# EAGLE schematic untitled (EAGLE 8.2.0)
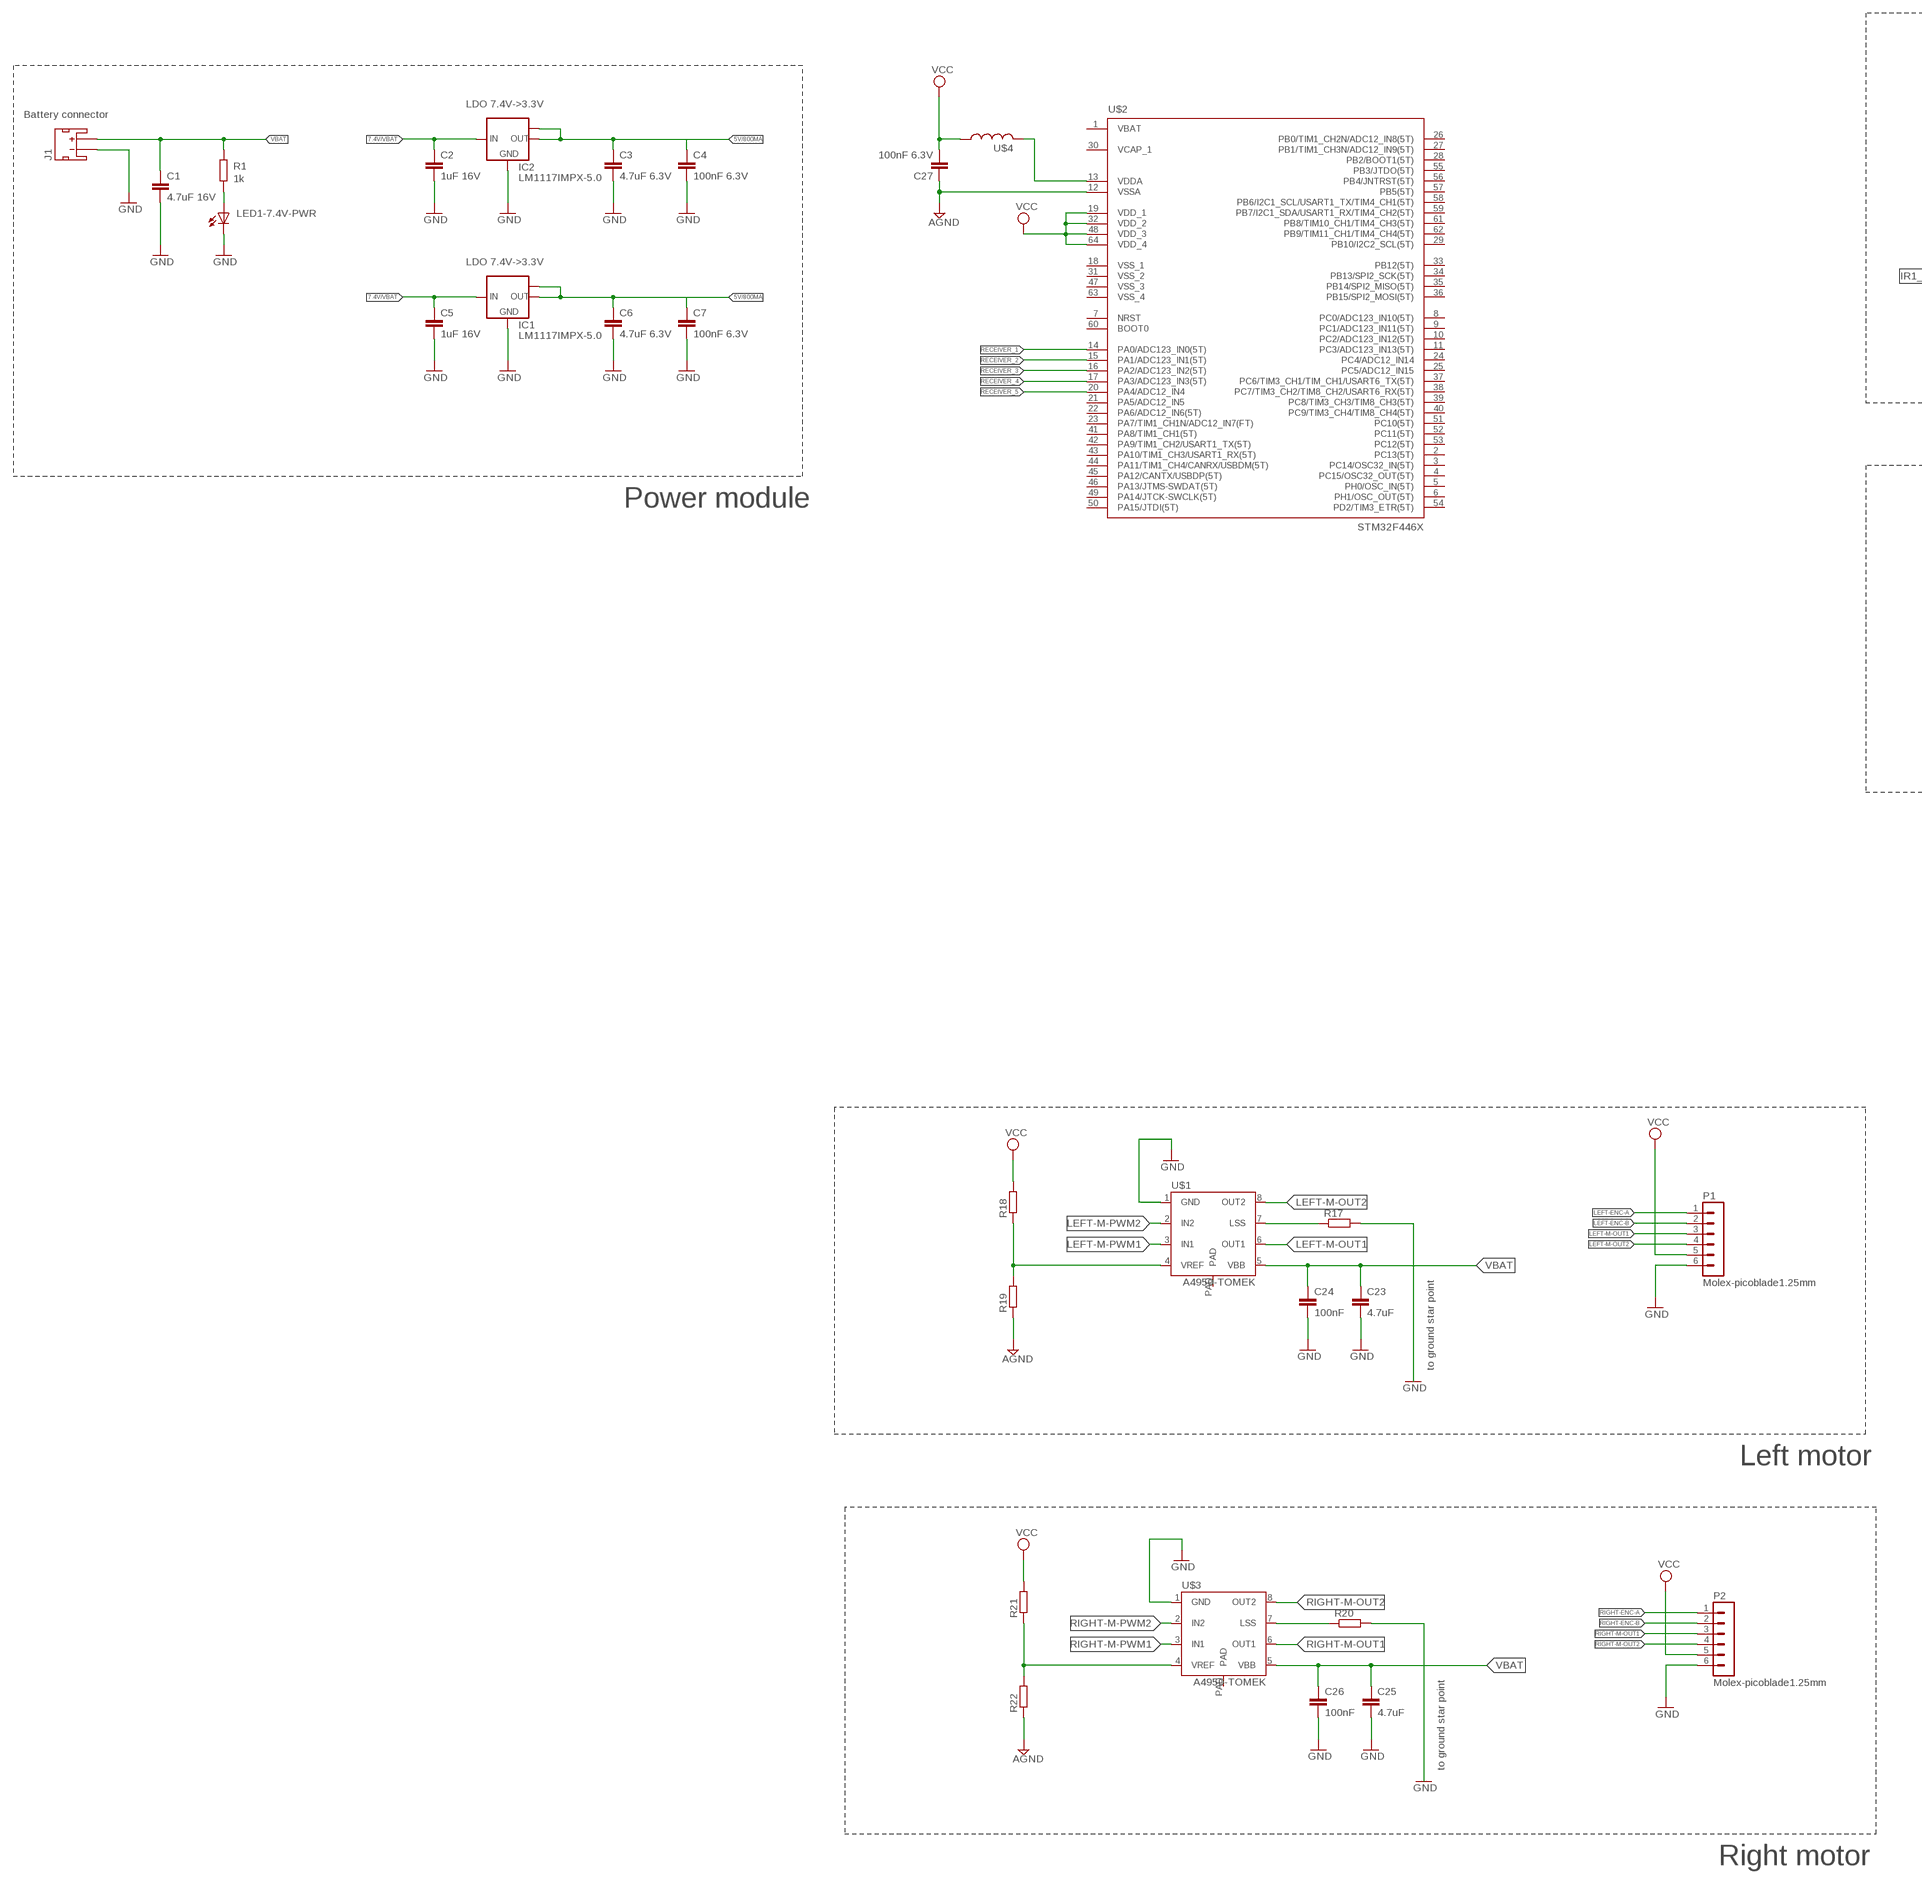
[diagram p0: schematic, sheet 1, part 1 of 2]
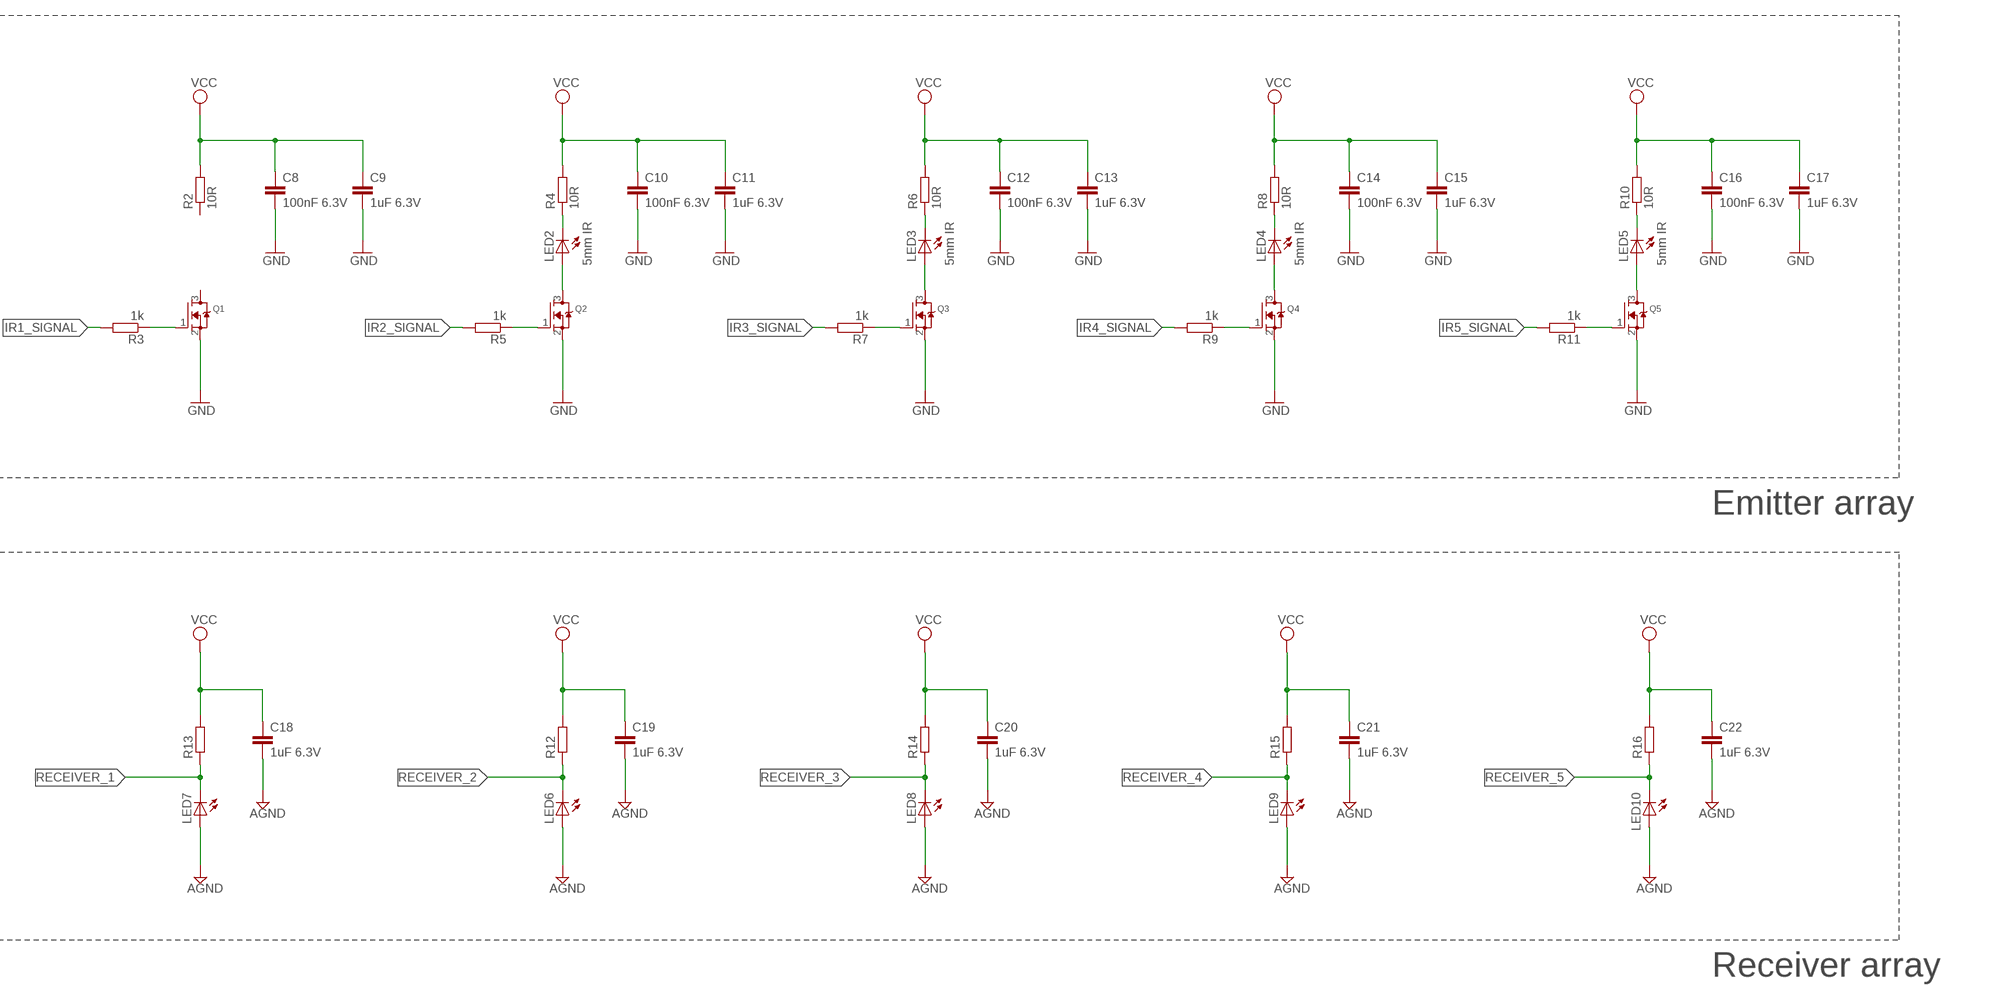
[diagram p1: schematic, sheet 1, part 2 of 2]

## Parts
C1  4.7uF 16V  C-EUC0805K  [C0805K]
C2  1uF 16V  C-EUC0805K  [C0805K]
C3  4.7uF 6.3V  C-EUC0805K  [C0805K]
C4  100nF 6.3V  C-EUC0805K  [C0805K]
C5  1uF 16V  C-EUC0805K  [C0805K]
C6  4.7uF 6.3V  C-EUC0805K  [C0805K]
C7  100nF 6.3V  C-EUC0805K  [C0805K]
C8  100nF 6.3V  C-EUC0805K  [C0805K]
C9  1uF 6.3V  C-EUC0805K  [C0805K]
C10  100nF 6.3V  C-EUC0805K  [C0805K]
C11  1uF 6.3V  C-EUC0805K  [C0805K]
C12  100nF 6.3V  C-EUC0805K  [C0805K]
C13  1uF 6.3V  C-EUC0805K  [C0805K]
C14  100nF 6.3V  C-EUC0805K  [C0805K]
C15  1uF 6.3V  C-EUC0805K  [C0805K]
C16  100nF 6.3V  C-EUC0805K  [C0805K]
C17  1uF 6.3V  C-EUC0805K  [C0805K]
C18  1uF 6.3V  C-EUC0805K  [C0805K]
C19  1uF 6.3V  C-EUC0805K  [C0805K]
C20  1uF 6.3V  C-EUC0805K  [C0805K]
C21  1uF 6.3V  C-EUC0805K  [C0805K]
C22  1uF 6.3V  C-EUC0805K  [C0805K]
C23  4.7uF  C-EUC0805K  [C0805K]
C24  100nF  C-EUC0805K  [C0805K]
C25  4.7uF  C-EUC0805K  [C0805K]
C26  100nF  C-EUC0805K  [C0805K]
C27  100nF 6.3V  C-EUC0805K  [C0805K]
IC1  LM1117IMPX-5.0  [SOT223]
IC2  LM1117IMPX-5.0  [SOT223]
J1  JST_2MM_MALE  [JST-2-SMD]
LED1-7.4V-PWR  LEDCHIP-LED0805  [CHIP-LED0805]
LED2  5mm IR  LED5MM  [LED5MM]
LED3  5mm IR  LED5MM  [LED5MM]
LED4  5mm IR  LED5MM  [LED5MM]
LED5  5mm IR  LED5MM  [LED5MM]
LED6  LED5MM  [LED5MM]
LED7  LED5MM  [LED5MM]
LED8  LED5MM  [LED5MM]
LED9  LED5MM  [LED5MM]
LED10  LED5MM  [LED5MM]
P1  Molex-picoblade1.25mm  53398-0610  [53398-0610]
P2  Molex-picoblade1.25mm  53398-0610  [53398-0610]
Q1  MOSFET-NREFLOW  [SOT23]
Q2  MOSFET-NREFLOW  [SOT23]
Q3  MOSFET-NREFLOW  [SOT23]
Q4  MOSFET-NREFLOW  [SOT23]
Q5  MOSFET-NREFLOW  [SOT23]
R1  1k  R-EU_R0805  [R0805]
R2  10R  R-EU_M0805  [M0805]
R3  1k  R-EU_M0805  [M0805]
R4  10R  R-EU_M0805  [M0805]
R5  1k  R-EU_M0805  [M0805]
R6  10R  R-EU_M0805  [M0805]
R7  1k  R-EU_M0805  [M0805]
R8  10R  R-EU_M0805  [M0805]
R9  1k  R-EU_M0805  [M0805]
R10  10R  R-EU_M0805  [M0805]
R11  1k  R-EU_M0805  [M0805]
R12  R-EU_R0805  [R0805]
R13  R-EU_R0805  [R0805]
R14  R-EU_R0805  [R0805]
R15  R-EU_R0805  [R0805]
R16  R-EU_R0805  [R0805]
R17  R-EU_R2512  [R2512]
R18  R-EU_R0805  [R0805]
R19  R-EU_R0805  [R0805]
R20  R-EU_R2512  [R2512]
R21  R-EU_R0805  [R0805]
R22  R-EU_R0805  [R0805]
U$1  A4950-TOMEK  [SOIC8TP]
U$2  STM32F446X  [TQFP64]
U$3  A4950-TOMEK  [SOIC8TP]
U$4  INDUCTOR_0805_L  [RESC0805_L]

## Nets
5V/800MA: C3.1 C6.1 IC1.2(OUT) IC1.TAB(OUT1) IC2.2(OUT) IC2.TAB(OUT1)
5V/800MA1: C4.1
5V/800MA2: C7.1
7.4V/VBAT: C2.1 C5.1 IC1.3(IN) IC2.3(IN)
AGND: C18.2 C19.2 C20.2 C21.2 C22.2 C27.1 LED6.A LED7.A LED8.A LED9.A LED10.A R19.1 R22.1 U$2.12(VSSA)
GND: C1.2 C2.2 C3.2 C4.2 C5.2 C6.2 C7.2 C8.2 C9.2 C10.2 C11.2 C12.2 C13.2 C14.2 C15.2 C16.2 C17.2 C23.2 C24.2 C25.2 C26.2 IC1.1(GND) IC2.1(GND) J1.1(-) LED1-7.4V-PWR.C P1.6 P2.6 Q1.2(S) Q2.2(S) Q3.2(S) Q4.2(S) Q5.2(S) R17.2 R20.2 U$1.1(GND) U$3.1(GND)
IR1_SIGNAL: R3.2
IR2_SIGNAL: R5.2
IR3_SIGNAL: R7.2
IR4_SIGNAL: R9.2
IR5_SIGNAL: R11.2
LEFT-ENC-A: P1.1
LEFT-ENC-B: P1.2
LEFT-M-OUT1: P1.3 U$1.6(OUT1)
LEFT-M-OUT2: P1.4 U$1.8(OUT2)
LEFT-M-PWM1: U$1.3(IN1)
LEFT-M-PWM2: U$1.2(IN2)
N$1: LED1-7.4V-PWR.A R1.1
N$2: Q1.1(G) R3.1
N$5: Q2.1(G) R5.1
N$6: LED2.A Q2.3(D)
N$7: LED2.K(C) R4.1
N$8: Q3.1(G) R7.1
N$9: LED3.A Q3.3(D)
N$10: LED3.K(C) R6.1
N$11: Q4.1(G) R9.1
N$12: LED4.A Q4.3(D)
N$13: LED4.K(C) R8.1
N$14: Q5.1(G) R11.1
N$15: LED5.A Q5.3(D)
N$16: LED5.K(C) R10.1
N$17: R17.1 U$1.7(LSS)
N$18: R18.1 R19.2 U$1.4(VREF)
N$19: R20.1 U$3.7(LSS)
N$20: R21.1 R22.2 U$3.4(VREF)
N$22: U$2.13(VDDA) U$4.2
RECEIVER_1: LED7.K(C) R13.1 U$2.14(PA0/ADC123_IN0(5T))
RECEIVER_2: LED6.K(C) R12.1 U$2.15(PA1/ADC123_IN1(5T))
RECEIVER_3: LED8.K(C) R14.1 U$2.16(PA2/ADC123_IN2(5T))
RECEIVER_4: LED9.K(C) R15.1 U$2.17(PA3/ADC123_IN3(5T))
RECEIVER_5: LED10.K(C) R16.1 U$2.20(PA4/ADC12_IN4)
RIGHT-ENC-A: P2.1
RIGHT-ENC-B: P2.2
RIGHT-M-OUT1: P2.3 U$3.6(OUT1)
RIGHT-M-OUT2: P2.4 U$3.8(OUT2)
RIGHT-M-PWM1: U$3.3(IN1)
RIGHT-M-PWM2: U$3.2(IN2)
VBAT: C1.1 C23.1 C24.1 C25.1 C26.1 J1.2(+) R1.2 U$1.5(VBB) U$3.5(VBB)
VCC: C8.1 C9.1 C10.1 C11.1 C12.1 C13.1 C14.1 C15.1 C16.1 C17.1 C18.1 C19.1 C20.1 C21.1 C22.1 C27.2 P1.5 P2.5 R2.2 R4.2 R6.2 R8.2 R10.2 R12.2 R13.2 R14.2 R15.2 R16.2 R18.2 R21.2 U$2.19(VDD_1) U$2.32(VDD_2) U$2.48(VDD_3) U$2.64(VDD_4) U$4.1
Unconnected: J1.NC1(PAD1) J1.NC2(PAD2) Q1.3(D) R2.1 U$1.PAD U$2.1(VBAT) U$2.2(PC13(5T)) U$2.3(PC14/OSC32_IN(5T)) U$2.4(PC15/OSC32_OUT(5T)) U$2.5(PH0/OSC_IN(5T)) U$2.6(PH1/OSC_OUT(5T)) U$2.7(NRST) U$2.8(PC0/ADC123_IN10(5T)) U$2.9(PC1/ADC123_IN11(5T)) U$2.10(PC2/ADC123_IN12(5T)) U$2.11(PC3/ADC123_IN13(5T)) U$2.18(VSS_1) U$2.21(PA5/ADC12_IN5) U$2.22(PA6/ADC12_IN6(5T)) U$2.23(PA7/TIM1_CH1N/ADC12_IN7(FT)) U$2.24(PC4/ADC12_IN14) U$2.25(PC5/ADC12_IN15) U$2.26(PB0/TIM1_CH2N/ADC12_IN8(5T)) U$2.27(PB1/TIM1_CH3N/ADC12_IN9(5T)) U$2.28(PB2/BOOT1(5T)) U$2.29(PB10/I2C2_SCL(5T)) U$2.30(VCAP_1) U$2.31(VSS_2) U$2.33(PB12(5T)) U$2.34(PB13/SPI2_SCK(5T)) U$2.35(PB14/SPI2_MISO(5T)) U$2.36(PB15/SPI2_MOSI(5T)) U$2.37(PC6/TIM3_CH1/TIM_CH1/USART6_TX(5T)) U$2.38(PC7/TIM3_CH2/TIM8_CH2/USART6_RX(5T)) U$2.39(PC8/TIM3_CH3/TIM8_CH3(5T)) U$2.40(PC9/TIM3_CH4/TIM8_CH4(5T)) U$2.41(PA8/TIM1_CH1(5T)) U$2.42(PA9/TIM1_CH2/USART1_TX(5T)) U$2.43(PA10/TIM1_CH3/USART1_RX(5T)) U$2.44(PA11/TIM1_CH4/CANRX/USBDM(5T)) U$2.45(PA12/CANTX/USBDP(5T)) U$2.46(PA13/JTMS-SWDAT(5T)) U$2.47(VSS_3) U$2.49(PA14/JTCK-SWCLK(5T)) U$2.50(PA15/JTDI(5T)) U$2.51(PC10(5T)) U$2.52(PC11(5T)) U$2.53(PC12(5T)) U$2.54(PD2/TIM3_ETR(5T)) U$2.55(PB3/JTDO(5T)) U$2.56(PB4/JNTRST(5T)) U$2.57(PB5(5T)) U$2.58(PB6/I2C1_SCL/USART1_TX/TIM4_CH1(5T)) U$2.59(PB7/I2C1_SDA/USART1_RX/TIM4_CH2(5T)) U$2.60(BOOT0) U$2.61(PB8/TIM10_CH1/TIM4_CH3(5T)) U$2.62(PB9/TIM11_CH1/TIM4_CH4(5T)) U$2.63(VSS_4) U$3.PAD

## Notes on the sheet
- LDO 7.4V->3.3V
- Battery connector
- LDO 7.4V->3.3V
- Emitter array
- Power module
- Receiver array
- to ground star point
- Left motor
- to ground star point
- Right motor

## Library data of the parts
C1-C27 = rcl:C-EU: CAPACITOR, European symbol
IC1 IC2 = lm1117:LM1117IMPX-*
J1 = SparkFun-Connectors:JST_2MM_MALE: JST 2MM MALE RA CONNECTOR Two pin, compact surface mount connector. Commonly used as a battery input connection point. We really like the solid locking feeling and high current rating on these small connectors. We use these all the time as battery connectors. Mates to single-cell LiPo batteries. Here is the connector we sell at SparkFun: JST Right Angle Connector - White <https://www.sparkfun.com/products/8612> (PRT-08612) Datasheet <http://www.sparkfun.com/datasheets/Prototyping/Connectors/JST-Horizontal.pdf> It was used on these SparkFun products: SparkFun MOSFET Power Controller <https://www.sparkfun.com/products/11214> (PRT-11214) SparkFun Battery Babysitter - LiPo Battery Manager <https://www.sparkfun.com/products/13777> (PRT-13777) And many, many others that required a lipo battery connection.; PROD_ID: CONN-11443; SF_ID: PRT-08612
LED1-7.4V-PWR LED2-LED10 = adafruit:LED: LED OSRAM: - CHIPLED LG R971, LG N971, LY N971, LG Q971, LY Q971, LO R971, LY R971 LH N974, LH R974 LS Q976, LO Q976, LY Q976 LO Q996 - Hyper CHIPLED LW Q18S LB Q993, LB Q99A, LB R99A - SideLED LS A670, LO A670, LY A670, LG A670, LP A670 LB A673, LV A673, LT A673, LW A673 LH A674 LY A675 LS A676, LA A676, LO A676, LY A676, LW A676 LS A679, LY A679, LG A679 - Hyper Micro SIDELED® LS Y876, LA Y876, LO Y876, LY Y876 LT Y87S - SmartLED LW L88C, LW L88S LB L89C, LB L89S, LG L890 LS L89K, LO L89K, LY L89K LS L896, LA L896, LO L896, LY L896 - TOPLED LS T670, LO T670, LY T670, LG T670, LP T670 LSG T670, LSP T670, LSY T670, LOP T670, LYG T670 LG T671, LOG T671, LSG T671 LB T673, LV T673, LT T673, LW T673 LH T674 LS T676, LA T676, LO T676, LY T676, LB T676, LH T676, LSB T676, LW T676 LB T67C, LV T67C, LT T67C, LS T67K, LO T67K, LY T67K, LW E67C LS E67B, LA E67B, LO E67B, LY E67B, LB E67C, LV E67C, LT E67C LW T67C LS T679, LY T679, LG T679 LS T770, LO T770, LY T770, LG T770, LP T770 LB T773, LV T773, LT T773, LW T773 LH T774 LS E675, LA E675, LY E675, LS T675 LS T776, LA T776, LO T776, LY T776, LB T776 LHGB T686 LT T68C, LB T68C - Hyper Mini TOPLED® LB M676 - Mini TOPLED Santana® LG M470 LS M47K, LO M47K, LY M47K Source: http://www.osram.convergy.de/
P1 P2 = molex-pico:53398-0610: HEADER
Q1-Q5 = adafruit:MOSFET-N: N-Channel Mosfet 2N7002E - 60V 260mA SOT23 [Digikey: 2N7002ET1GOSTR-ND] - REEL BSH103 - 30V 850mA SOT23 [Digikey: 568-5013-1-ND]
R1 = resistor:R-EU_: RESISTOR, European symbol
R2-R22 = rcl:R-EU_: RESISTOR, European symbol
U$1 U$3 = allegro_a4950:A4950-TOMEK
U$2 = stm32f4:STM32F446X
U$4 = Nordic_nRF:INDUCTOR: Generic chip inductor